# EAGLE design B201E (EAGLE 6.6.0)
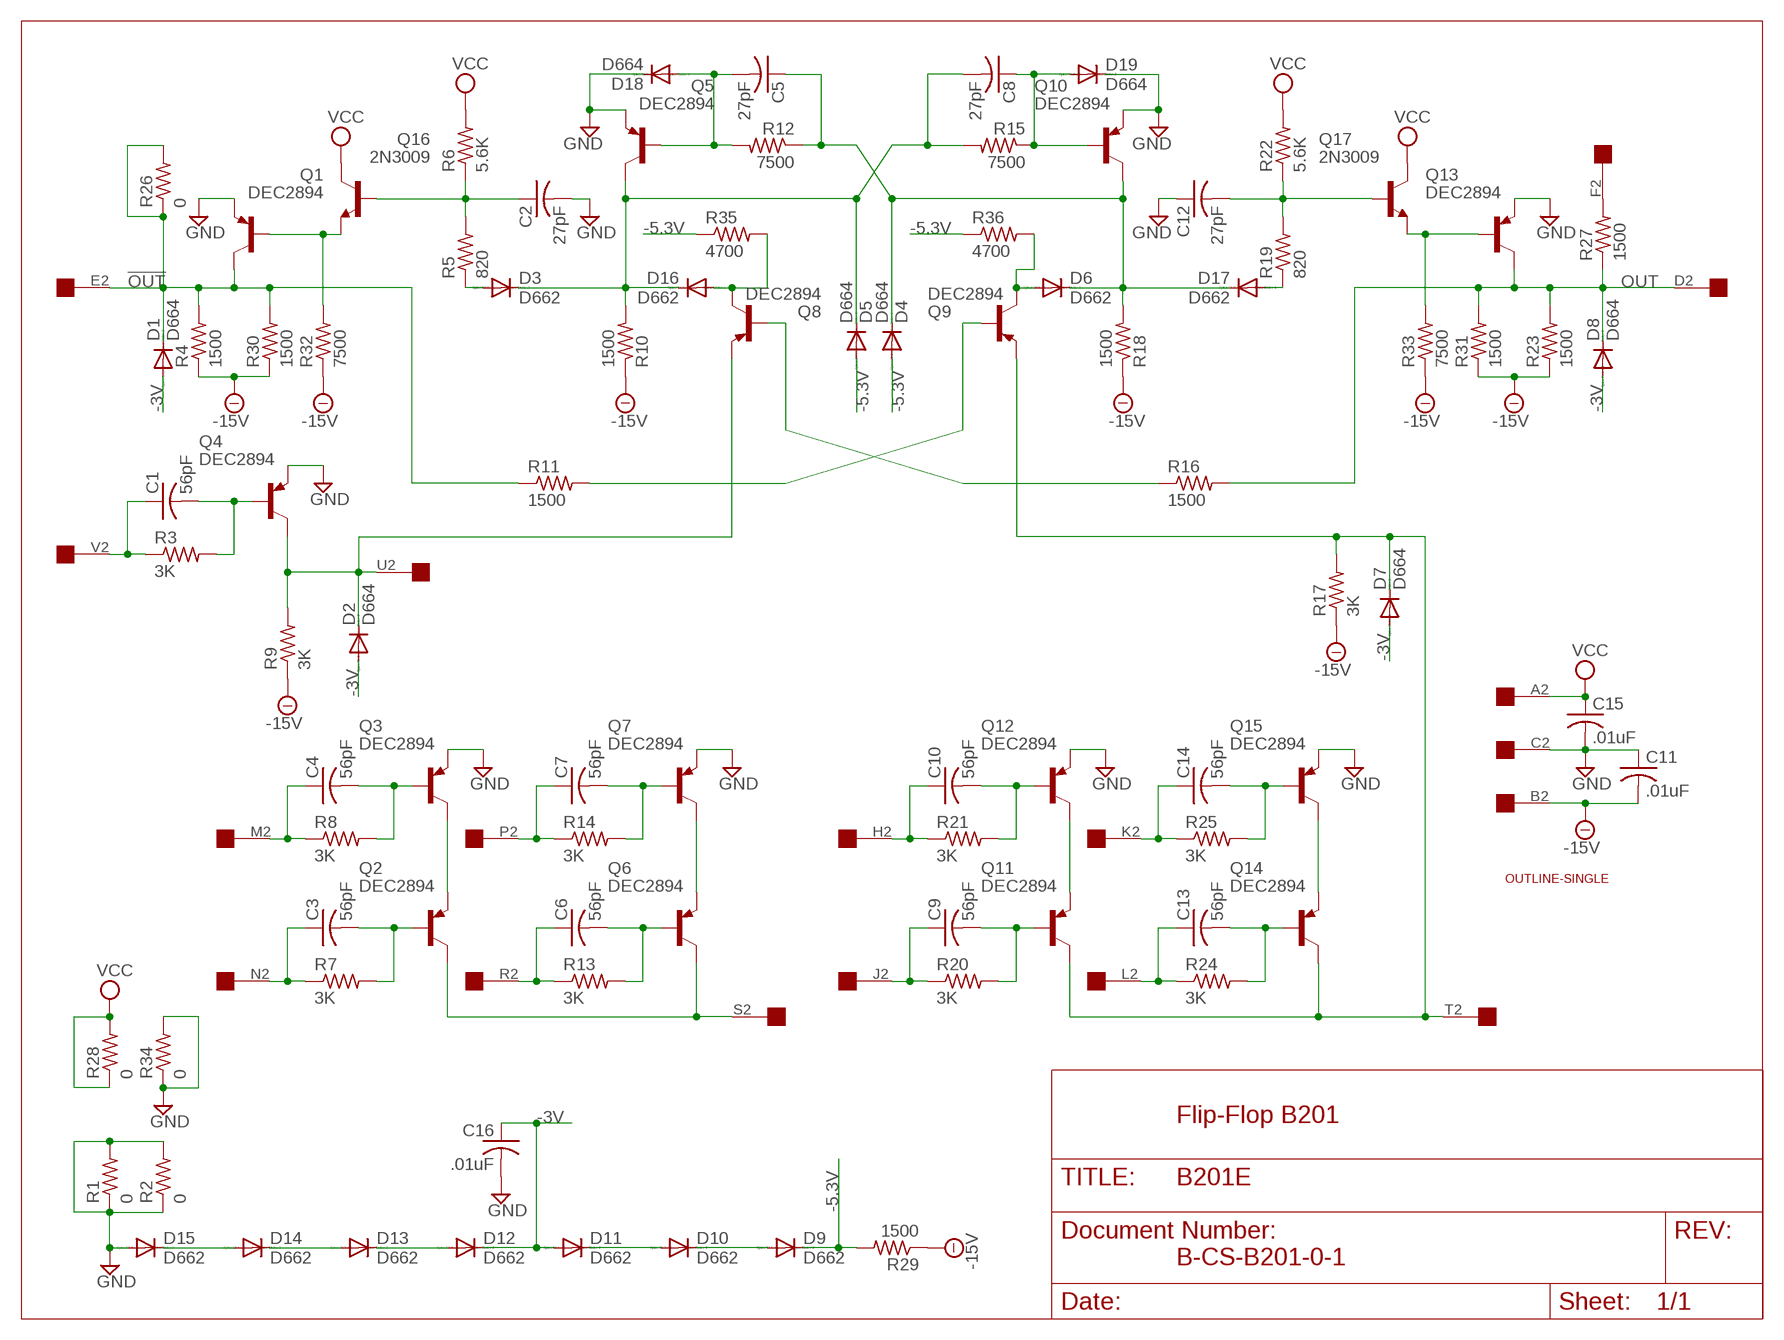
[diagram p0: schematic, sheet 1]

## Parts
C1  56pF  C-US  [C063-025X075]
C2  27pF  C-US  [C063-025X075]
C3  56pF  C-US  [C063-025X075]
C4  56pF  C-US  [C063-025X075]
C5  27pF  C-US  [C063-025X075]
C6  56pF  C-US  [C063-025X075]
C7  56pF  C-US  [C063-025X075]
C8  27pF  C-US  [C063-025X075]
C9  56pF  C-US  [C063-025X075]
C10  56pF  C-US  [C063-025X075]
C11  .01uF  C-US  [C063-025X075]
C12  27pF  C-US  [C063-025X075]
C13  56pF  C-US  [C063-025X075]
C14  56pF  C-US  [C063-025X075]
C15  .01uF  C-US  [C063-025X075]
C16  .01uF  C-US  [C063-025X075]
D1  D664  DIODE-DO35-10  [DO35-10]
D2  D664  DIODE-DO35-10  [DO35-10]
D3  D662  DIODE-DO35-10  [DO35-10]
D4  D664  DIODE-DO35-10  [DO35-10]
D5  D664  DIODE-DO35-10  [DO35-10]
D6  D662  DIODE-DO35-10  [DO35-10]
D7  D664  DIODE-DO35-10  [DO35-10]
D8  D664  DIODE-DO35-10  [DO35-10]
D9  D662  DIODE-DO35-10  [DO35-10]
D10  D662  DIODE-DO35-10  [DO35-10]
D11  D662  DIODE-DO35-10  [DO35-10]
D12  D662  DIODE-DO35-10  [DO35-10]
D13  D662  DIODE-DO35-10  [DO35-10]
D14  D662  DIODE-DO35-10  [DO35-10]
D15  D662  DIODE-DO35-10  [DO35-10]
D16  D662  DIODE-DO35-10  [DO35-10]
D17  D662  DIODE-DO35-10  [DO35-10]
D18  D664  DIODE-DO35-10  [DO35-10]
D19  D664  DIODE-DO35-10  [DO35-10]
Q1  DEC2894  -PNP-TO5  [TO5]
Q2  DEC2894  -PNP-TO5  [TO5]
Q3  DEC2894  -PNP-TO5  [TO5]
Q4  DEC2894  -PNP-TO5  [TO5]
Q5  DEC2894  -PNP-TO5  [TO5]
Q6  DEC2894  -PNP-TO5  [TO5]
Q7  DEC2894  -PNP-TO5  [TO5]
Q8  DEC2894  -PNP-TO5  [TO5]
Q9  DEC2894  -PNP-TO5  [TO5]
Q10  DEC2894  -PNP-TO5  [TO5]
Q11  DEC2894  -PNP-TO5  [TO5]
Q12  DEC2894  -PNP-TO5  [TO5]
Q13  DEC2894  -PNP-TO5  [TO5]
Q14  DEC2894  -PNP-TO5  [TO5]
Q15  DEC2894  -PNP-TO5  [TO5]
Q16  2N3009  -NPN-TO5  [TO5]
Q17  2N3009  -NPN-TO5  [TO5]
R1  0  R-US_0207/10  [0207/10]
R2  0  R-US_0207/10  [0207/10]
R3  3K  R-US_0207/10  [0207/10]
R4  1500  R-US_0207/10  [0207/10]
R5  820  R-US_0207/10  [0207/10]
R6  5.6K  R-US_0207/10  [0207/10]
R7  3K  R-US_0207/10  [0207/10]
R8  3K  R-US_0207/10  [0207/10]
R9  3K  R-US_0207/10  [0207/10]
R10  1500  R-US_0207/10  [0207/10]
R11  1500  R-US_0207/10  [0207/10]
R12  7500  R-US_0207/10  [0207/10]
R13  3K  R-US_0207/10  [0207/10]
R14  3K  R-US_0207/10  [0207/10]
R15  7500  R-US_0207/10  [0207/10]
R16  1500  R-US_0207/10  [0207/10]
R17  3K  R-US_0207/10  [0207/10]
R18  1500  R-US_0207/10  [0207/10]
R19  820  R-US_0207/10  [0207/10]
R20  3K  R-US_0207/10  [0207/10]
R21  3K  R-US_0207/10  [0207/10]
R22  5.6K  R-US_0207/10  [0207/10]
R23  1500  R-US_0207/10  [0207/10]
R24  3K  R-US_0207/10  [0207/10]
R25  3K  R-US_0207/10  [0207/10]
R26  0  R-US_0207/10  [0207/10]
R27  1500  R-US_0207/10  [0207/10]
R28  0  R-US_0207/10  [0207/10]
R29  1500  R-US_0207/10  [0207/10]
R30  1500  R-US_0207/10  [0207/10]
R31  1500  R-US_0207/10  [0207/10]
R32  7500  R-US_0207/10  [0207/10]
R33  7500  R-US_0207/10  [0207/10]
R34  0  R-US_0207/10  [0207/10]
R35  4700  R-US_0207/10  [0207/10]
R36  4700  R-US_0207/10  [0207/10]
U$1  OUTLINE-SINGLE  [SINGLE]
U$2  EDGE-1  [EDGE-CON1]

## Nets
!OUT: D1.C Q1.3(C) R4.2 R11.1 R26.1 R26.2 R30.2 U$2.E2
-3V: C16.1 D1.A D2.A D7.A D8.A D11.A D12.C
-5.3V: D4.A D5.A D9.C R29.2 R35.1 R36.1
-15V: C11.2 R4.1 R9.1 R10.1 R17.1 R18.1 R23.1 R29.1 R30.1 R31.1 R32.1 R33.1 U$2.B2
-.75V: D14.A D15.C
GND: C2.2 C11.1 C12.1 C15.2 C16.2 D15.A D18.C D19.C Q1.1(E) Q3.1(E) Q4.1(E) Q5.1(E) Q7.1(E) Q10.1(E) Q12.1(E) Q13.1(E) Q15.1(E) R1.1 R1.2 R2.1 R2.2 R34.1 R34.2 U$2.C2
N$1: C4.1 R8.1 U$2.M2
N$2: C4.2 Q3.2(B) R8.2
N$3: C3.1 R7.1 U$2.N2
N$4: C3.2 Q2.2(B) R7.2
N$5: Q2.1(E) Q3.3(C)
N$6: Q2.3(C) Q6.3(C) U$2.S2
N$7: C7.1 R14.1 U$2.P2
N$8: C7.2 Q7.2(B) R14.2
N$9: C6.1 R13.1 U$2.R2
N$10: C6.2 Q6.2(B) R13.2
N$11: Q6.1(E) Q7.3(C)
N$12: C1.1 R3.1 U$2.V2
N$13: C10.1 R21.1 U$2.H2
N$14: C10.2 Q12.2(B) R21.2
N$15: C9.1 R20.1 U$2.J2
N$16: C9.2 Q11.2(B) R20.2
N$17: Q11.1(E) Q12.3(C)
N$18: D7.C Q9.1(E) Q11.3(C) Q14.3(C) R17.2 U$2.T2
N$19: C14.1 R25.1 U$2.K2
N$20: C14.2 Q15.2(B) R25.2
N$21: C13.1 R24.1 U$2.L2
N$22: C13.2 Q14.2(B) R24.2
N$23: Q14.1(E) Q15.3(C)
N$24: C1.2 Q4.2(B) R3.2
N$25: R27.2 U$2.F2
N$26: D2.C Q4.3(C) Q8.1(E) R9.2 U$2.U2
N$27: Q1.2(B) Q16.1(E) R32.2
N$28: D9.A D10.C
N$29: D10.A D11.C
N$30: C2.1 Q16.2(B) R5.2 R6.1
N$31: D13.A D14.C
N$32: D12.A D13.C
N$33: D3.A R5.1
N$35: C5.1 D4.C D6.C D17.C Q10.3(C) R12.1 R18.2
N$36: Q8.2(B) R16.1
N$37: C8.1 D19.A Q10.2(B) R15.1
N$38: C8.2 D3.C D5.C D16.C Q5.3(C) R10.2 R15.2
N$39: Q9.2(B) R11.2
N$40: C5.2 D18.A Q5.2(B) R12.2
N$42: D16.A Q8.3(C) R35.2
N$43: C12.2 Q17.2(B) R19.2 R22.1
N$44: D17.A R19.1
N$45: Q13.2(B) Q17.1(E) R33.2
N$50: D6.A Q9.3(C) R36.2
OUT: D8.C Q13.3(C) R16.2 R23.2 R27.1 R31.2 U$2.D2
VCC: C15.1 Q16.3(C) Q17.3(C) R6.2 R22.2 R28.1 R28.2 U$2.A2

## Notes on the sheet
- Flip-Flop B201
- B-CS-B201-0-1

## Library data of the parts
C1-C16 = dec-con:C-US: Capacitors with funky DEC lead spacing.
D1-D19 = diode:DIODE-: DIODE
Q1-Q15 = transistor:*-PNP-: PNP Transistror
Q16 Q17 = transistor:*-NPN-: NPN Transistror BF959 corrected 2008.03.06
R1-R36 = rcl:R-US_: RESISTOR, American symbol
U$1 = dec-con:OUTLINE-*: Board outlines for DEC boards.
U$2 = dec-con:EDGE-1: Single-Sided DEC Edge Connector -- (side 2)

## Board
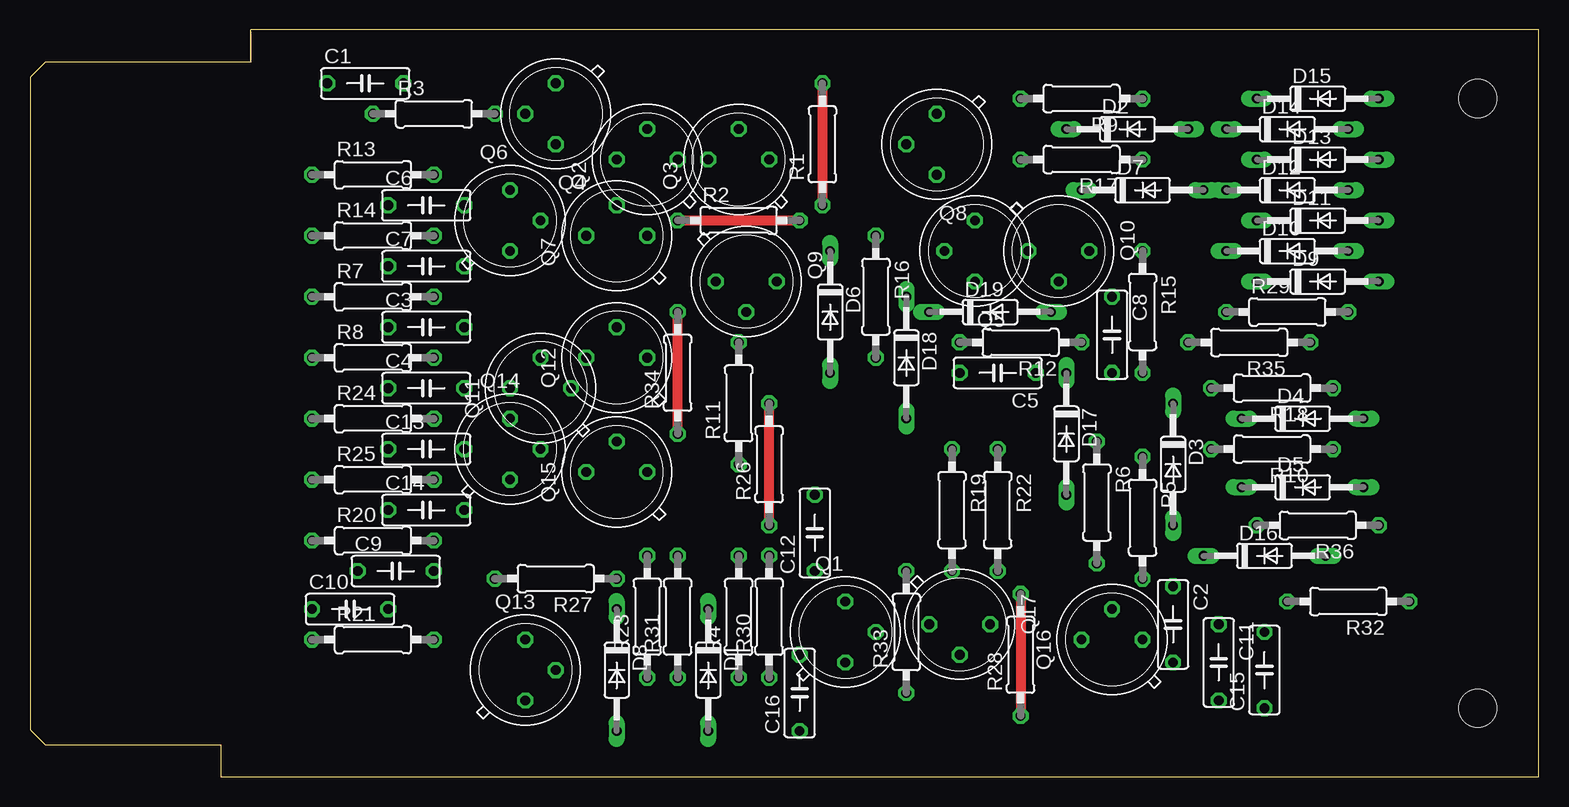
[diagram p1: board, top side]
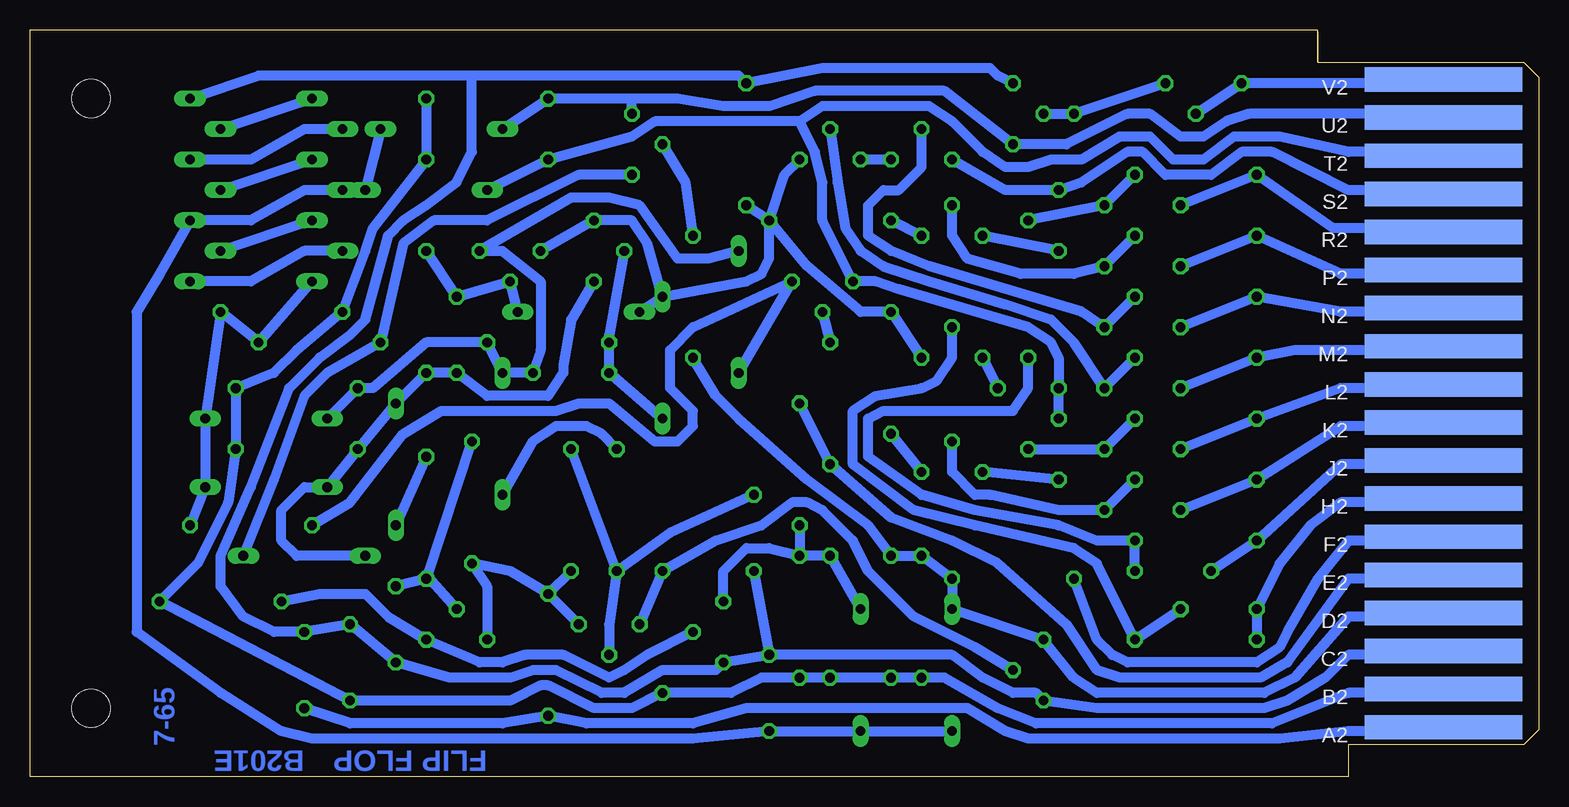
[diagram p2: board, bottom side, seen from below]

Size 125.73 x 62.23 mm. Coordinates in mm from the lower left corner, seen from the top.
Copper layers (1+16): Top 0.035mm / dielectric 1.5mm / Bottom 0.035mm
Design rules "16mils": minimum track width 16mil, minimum drill 32mil, track to track 15mil, track to pad 10mil, pad to pad 10mil, via to via 10mil, smd to smd 10mil, copper to edge 13mil, drill to drill 10mil, minimum pad ring 10mil, minimum via ring 8mil, stop-mask expansion 0mil, vias tented up to drill 0mil, thermal gap 10mil

### Footprints (pad centres in the part's own frame; a part is rotated, then mirrored left to right if it is on the bottom)
C063-025X075 = drill 0.813 octagon: 1 -2.54,0; 2 3.81,0
DO35-10 = drill 0.813 long: A 5.08,0; C -5.08,0
TO5 = drill 0.813 octagon: 1 0,-2.54; 2 2.54,0; 3 0,2.54
0207/10 = drill 0.813 octagon: 1 -5.08,0; 2 5.08,0
SINGLE = hole 3.175: 120.65,56.515; 120.65,5.715
EDGE-CON1 = smd 13.106 x 2.032 bottom: A2 7.938,4.128; B2 7.938,7.303; C2 7.938,10.477; D2 7.938,13.652; E2 7.938,16.828; F2 7.938,20.003; H2 7.938,23.177; J2 7.938,26.352; K2 7.938,29.527; L2 7.938,32.703; M2 7.938,35.877; N2 7.938,39.053; P2 7.938,42.227; R2 7.938,45.403; S2 7.938,48.578; T2 7.938,51.752; U2 7.938,54.928; V2 7.938,58.102

### Placement (x,y rotation side)
C1  27.31,57.78 0 top
C2  95.25,13.34 270 top
C3  32.39,37.47 0 top
C4  32.39,32.38 0 top
C5  81.28,33.66 180 top
C6  32.39,47.62 0 top
C7  32.39,42.55 0 top
C8  90.17,37.47 270 top
C9  29.85,17.14 0 top
C10  26.04,13.97 0 top
C11  99.06,10.16 270 top
C12  65.41,19.68 90 top
C13  32.39,27.3 0 top
C14  32.39,22.23 0 top
C15  102.87,8.26 90 top
C16  64.14,6.35 90 top
D1  56.52,8.89 270 top
D2  91.44,53.98 0 top
D3  95.25,26.04 270 top
D4  106.05,29.84 0 top
D5  106.05,24.13 0 top
D6  66.68,38.73 270 top
D7  92.71,48.9 0 top
D8  48.9,8.89 270 top
D9  107.32,41.27 0 top
D10  104.78,43.81 0 top
D11  107.32,46.35 0 top
D12  104.78,48.9 0 top
D13  107.32,51.44 0 top
D14  104.78,53.98 0 top
D15  107.32,56.52 0 top
D16  102.87,18.41 0 top
D17  86.36,28.57 270 top
D18  73.03,34.92 270 top
D19  80.01,38.73 0 top
Q1  67.95,12.06 0 top
Q2  51.44,51.44 90 top
Q3  59.06,51.44 90 top
Q4  43.82,55.24 180 top
Q5  78.74,43.81 180 top
Q6  40.01,46.35 0 top
Q7  48.9,45.09 90 top
Q8  75.57,52.7 180 top
Q9  59.69,41.27 270 top
Q10  85.73,43.81 270 top
Q11  42.55,32.38 90 top
Q12  48.9,34.92 90 top
Q13  41.28,8.89 0 top
Q14  40.01,27.3 0 top
Q15  48.9,25.4 90 top
Q16  90.17,11.43 90 top
Q17  77.47,12.7 270 top
R1  66.04,52.7 90 top
R2  59.06,46.35 0 top
R3  33.66,55.24 0 top
R4  59.06,13.34 90 top
R5  92.71,21.59 270 top
R6  88.9,22.86 270 top
R7  28.58,40.01 0 top
R8  28.58,34.92 0 top
R9  87.63,56.52 180 top
R10  103.51,27.3 180 top
R11  59.06,31.11 90 top
R12  82.55,36.2 180 top
R13  28.58,50.16 0 top
R14  28.58,45.09 0 top
R15  92.71,38.73 270 top
R16  70.49,40.01 270 top
R17  87.63,51.44 180 top
R18  103.51,32.38 180 top
R19  76.84,22.23 270 top
R20  28.58,19.68 0 top
R21  28.58,11.43 0 top
R22  80.65,22.23 270 top
R23  51.44,13.34 90 top
R24  28.58,29.84 0 top
R25  28.58,24.77 0 top
R26  61.6,26.04 90 top
R27  43.82,16.51 180 top
R28  82.55,10.16 90 top
R29  104.78,38.73 0 top
R30  61.6,13.34 90 top
R31  53.98,13.34 90 top
R32  109.86,14.61 180 top
R33  73.03,12.06 90 top
R34  53.98,33.66 90 top
R35  101.6,36.2 180 top
R36  107.32,20.95 180 top
U$1  0,0 0 top
U$2  0,0 0 top

### Tracks (layer width: path | path; a pad name or v marks a point on that pad's centre or on a via)
!OUT
  Top 0.813: R26.1 R26.2
  Bottom 0.813: U$2.E2 8.26,16.51 15.88,16.51 20.96,9.53 23.18,8.26 34.93,8.26 36.83,8.89 39.37,12.7 45.09,17.78 48.9,19.68 53.98,21.59 R11.1 R26.2 | R30.2 R4.2 D1.C | R26.1 R30.2 | Q1.3 67.95,17.14 66.04,19.05 64.14,19.05 R30.2
-3V
  Bottom 0.813: D8.A D1.A C16.1 70.49,3.17 102.24,3.17 104.78,3.81 109.86,6.99 116.84,12.06 116.84,38.73 114.94,41.91 D11.A 107.32,46.35 102.87,48.9 D12.C D7.A D2.A
-5.3V
  Bottom 0.813: D9.C R35.1 R29.2 D4.A D5.A R36.1
-15V
  Bottom 0.813: U$2.B2 8.26,6.99 15.88,6.99 22.23,4.45 41.91,4.45 45.09,5.71 49.53,8.26 R23.1 R31.1 R4.1 R30.1 64.77,8.26 67.31,6.99 R33.1 75.57,5.71 78.74,5.71 82.55,7.62 83.19,7.62 85.73,6.35 C11.2 R32.1 111.76,17.78 109.22,22.86 R10.1 R18.1 105.41,33.66 103.51,35.56 R29.1 97.79,43.81 97.16,45.72 R17.1 R9.1
-.75V
  Bottom 0.813: D15.C D14.A
GND
  Top 0.813: R1.2 R1.1 | R2.1 R2.2 | R34.1 R34.2
  Bottom 0.813: Q4.1 45.09,58.42 45.72,59.05 59.69,59.05 R1.2 66.68,58.42 88.9,58.42 | 88.9,58.42 106.68,58.42 D15.A | Q3.1 62.87,50.16 R2.2 | R2.2 R1.1 | Q12.1 R34.2 56.52,38.73 60.96,42.55 R2.2 | R2.1 Q7.1 | C16.2 Q1.1 68.58,8.89 73.03,8.89 76.2,6.99 78.11,6.99 81.92,8.89 83.82,8.89 85.73,8.26 90.81,8.26 C2.2 C11.1 C15.2 105.41,12.06 107.95,13.34 109.86,15.88 109.86,18.41 107.32,24.13 104.14,32.38 101.6,34.92 99.06,36.83 97.79,38.1 95.89,45.09 94.62,46.35 92.71,47.62 90.17,49.53 88.9,52.07 88.9,58.42 | U$2.C2 8.89,10.16 15.88,10.16 17.78,8.26 20.96,6.35 22.86,5.71 36.83,5.71 Q13.1 41.91,6.99 43.82,6.99 46.36,8.26 48.9,10.16 C16.2 | C12.1 C16.2 | Q15.1 R34.1 | D19.C D18.C | D18.C 74.3,44.45 75.57,46.35 Q5.1 Q10.1 | D18.C 66.04,41.27 64.77,41.91 64.14,43.18 R2.2
N$1
  Bottom 0.813: C4.1 R8.1 20.32,35.56 8.26,35.56 U$2.M2
N$2
  Bottom 0.813: R8.2 C4.2 38.74,36.2 40.64,38.1 44.45,39.37 50.8,41.27 54.61,42.55 56.52,43.81 57.79,45.72 58.42,49.53 Q3.2
N$3
  Bottom 0.813: C3.1 R7.1 16.51,38.73 8.26,38.73 U$2.N2
N$4
  Bottom 0.813: R7.2 C3.2 38.1,38.73 50.8,42.55 53.98,43.81 55.88,45.09 55.88,47.62 54.61,48.9 53.34,48.9 51.44,50.8 Q2.2
N$5
  Bottom 0.813: Q2.1 Q3.3
N$6
  Bottom 0.813: Q2.3 44.45,48.9 Q6.3 38.1,49.53 34.29,52.07 33.02,52.07 31.12,50.16 27.31,50.16 24.77,52.07 22.23,52.07 15.88,48.9 8.89,48.9 U$2.S2
N$7
  Bottom 0.813: C7.1 R14.1 16.51,41.91 8.89,41.91 U$2.P2
N$8
  Bottom 0.813: R14.2 C7.2 38.74,41.91 43.18,41.91 47.63,43.18 48.9,45.09 Q7.2
N$9
  Bottom 0.813: C6.1 R13.1 17.15,45.72 8.26,45.72 U$2.R2
N$10
  Bottom 0.813: Q6.2 C6.2 R13.2
N$11
  Bottom 0.813: Q6.1 Q7.3
N$12
  Bottom 0.813: R3.1 C1.1 8.89,57.78 U$2.V2
N$13
  Bottom 0.813: R21.1 C10.1 21.59,17.78 19.05,20.95 16.51,22.86 8.26,22.86 U$2.H2
N$14
  Bottom 0.813: C10.2 R21.2 36.83,17.78 38.74,19.05 46.99,20.95 52.07,22.23 57.15,26.04 57.15,30.48 55.25,31.75 51.44,32.38 50.17,33.02 48.9,34.92 Q12.2
N$15
  Bottom 0.813: C9.1 R20.1 16.51,26.04 8.26,26.04 U$2.J2
N$16
  Bottom 0.813: C9.2 R20.2 36.83,19.68 40.01,20.95 46.99,22.23 51.44,23.5 55.88,26.67 55.88,29.84 54.61,30.48 43.82,30.48 42.55,32.38 Q11.2
N$17
  Bottom 0.813: Q12.3 Q11.1
N$18
  Bottom 0.813: 61.6,54.61 60.33,52.07 59.69,49.53 59.69,46.35 Q9.1 55.25,41.27 53.34,40.64 42.55,37.47 40.64,36.2 40.01,34.92 Q11.3 Q14.3 | 61.6,54.61 73.66,54.61 75.57,53.34 R17.2 D7.C | 61.6,54.61 59.69,55.88 50.8,55.88 48.9,54.61 46.36,52.07 44.45,50.8 42.55,50.8 40.64,51.44 38.1,51.44 34.93,53.34 32.39,53.34 30.48,51.44 27.94,51.44 25.4,53.34 21.59,53.34 15.88,52.07 8.89,52.07 U$2.T2
N$19
  Bottom 0.813: C14.1 R25.1 16.51,29.21 8.89,29.21 U$2.K2
N$20
  Bottom 0.813: R25.2 C14.2 40.01,22.23 45.72,23.5 46.99,23.5 48.9,25.4 Q15.2
N$21
  Bottom 0.813: C13.1 R24.1 16.51,32.38 8.26,32.38 U$2.L2
N$22
  Bottom 0.813: R24.2 C13.2 Q14.2
N$23
  Bottom 0.813: Q14.1 Q15.3
N$24
  Bottom 0.813: C1.2 R3.2 Q4.2
N$25
  Bottom 0.813: U$2.F2 8.89,19.68 15.88,19.68 18.42,16.51 20.96,12.06 21.59,10.79 23.5,9.53 34.29,9.53 35.56,10.16 36.83,11.43 R27.2
N$26
  Bottom 0.813: U$2.U2 8.89,55.24 24.13,55.24 26.04,54.61 27.94,53.34 29.85,53.34 32.39,55.24 34.29,55.24 39.37,52.7 Q4.3 49.53,57.15 60.33,57.15 64.14,55.88 67.95,55.88 71.76,56.52 75.57,56.52 | 75.57,56.52 R9.2 D2.C | Q8.1 75.57,56.52
N$27
  Bottom 0.813: Q1.2 74.3,10.16 76.2,8.89 77.47,8.26 81.28,10.16 84.46,10.16 86.36,9.53 88.27,9.53 Q16.1 95.89,13.34 97.79,15.24 101.6,15.24 R32.2
N$28
  Bottom 0.813: D10.C 102.87,43.81 107.32,41.27 D9.A
N$29
  Bottom 0.813: D11.C D10.A
N$30
  Bottom 0.813: R6.1 92.65,16.7 | 92.65,16.7 R5.2 C2.1 | Q16.2 92.65,16.7
N$31
  Bottom 0.813: D14.C 102.87,53.98 107.32,51.44 D13.A
N$32
  Bottom 0.813: D13.C D12.A
N$33
  Bottom 0.813: R5.1 D3.A
N$35
  Bottom 0.813: D4.C R18.2 97.16,32.38 92.71,36.2 R12.1 D17.C C5.1 83.19,35.56 83.19,41.27 86.36,43.81 Q10.3 80.65,48.26 77.47,48.26 74.93,47.62 71.76,43.18 69.22,43.18 D6.C
N$36
  Bottom 0.813: Q8.2 71.12,49.53 R16.1
N$37
  Bottom 0.813: D19.A Q10.2 C8.1 R15.1
N$38
  Bottom 0.813: Q5.3 80.65,38.1 81.28,34.29 81.28,33.66 82.55,31.75 87.63,31.75 C8.2 R15.2 D3.C R10.2 D5.C 102.87,24.13 104.78,22.23 104.78,19.68 103.51,18.41 D16.C
N$39
  Bottom 0.813: Q9.2 R11.2
N$40
  Bottom 0.813: Q5.2 77.47,36.83 R12.2 C5.2 D18.A
N$42
  Bottom 0.813: Q8.3 80.01,50.16 87.63,46.35 92.08,46.35 94.62,44.45 R35.2 100.97,33.66 102.87,31.75 105.41,24.77 D16.A
N$43
  Bottom 0.813: C12.2 72.39,20.32 R19.2 | R19.2 77.47,12.7 Q17.2 | R19.2 R22.1
N$44
  Bottom 0.813: R19.1 78.11,28.57 79.38,29.21 81.92,29.21 83.82,27.94 D17.A
N$45
  Bottom 0.813: Q13.2 46.99,10.79 52.07,13.34 55.88,17.14 57.15,19.68 59.69,22.23 60.96,22.86 62.23,22.86 64.77,20.95 68.58,19.68 R33.2 Q17.1
N$50
  Bottom 0.813: R36.2 99.06,22.86 94.62,28.57 91.44,30.48 81.92,30.48 80.01,31.11 77.47,31.11 73.66,27.94 71.76,27.94 70.49,29.21 70.49,30.48 72.39,32.38 72.39,35.56 70.49,37.47 Q9.3 D6.A
OUT
  Bottom 0.813: U$2.D2 8.26,13.34 15.88,13.34 20.32,8.26 22.86,6.99 36.83,6.99 38.74,8.26 Q13.3 D8.C R27.1 R23.2 R31.2 55.88,20.95 60.96,24.77 66.68,29.84 68.58,31.75 R16.2
VCC
  Top 0.813: R28.2 R28.1
  Bottom 0.813: U$2.A2 8.89,3.81 15.88,3.81 21.59,3.17 42.55,3.17 44.45,3.81 47.63,5.71 66.04,5.71 70.49,4.45 79.38,4.45 R28.1 86.36,4.45 99.06,4.45 C15.1 | Q17.3 R28.2 | R28.2 85.73,17.14 R6.2 87.63,15.88 Q16.3 | R22.2 R28.2

### Text on the board
Bottom: 7-65 | FLIP FLOP | B201E